# Altium schematic sheet Recovery.SchDoc
size Letter; Organization: Altium Limited; Address1: L3, 12a Rodborough Rd; Address2: Frenchs Forest; Address3: NSW; Address4: Australia 2086
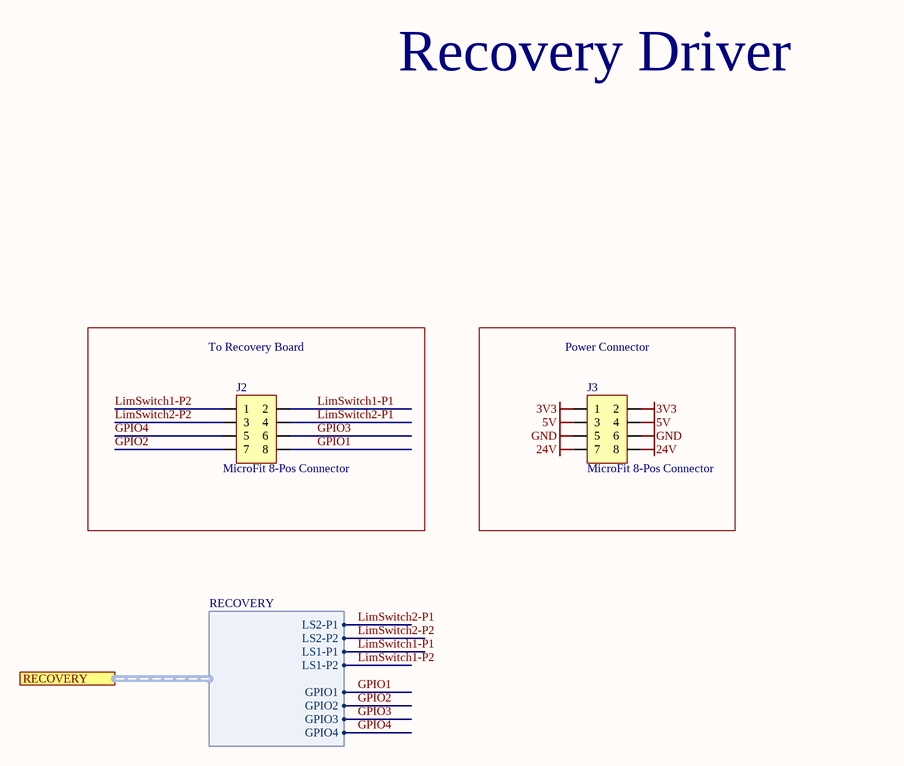
[diagram p0: Recovery.SchDoc]

## Parts
J2  MicroFit 8-Pos Connector  [Microfit-8Pos]
J3  MicroFit 8-Pos Connector  [Microfit-8Pos]

## Blocks framed on the sheet
To Recovery Board: J2
Power Connector: J3

## Ports
RECOVERY (harness RECOVERY)

## Harnesses
RECOVERY: LS2-P1, LS2-P2, LS1-P1, LS1-P2, GPIO1, GPIO2, GPIO3, GPIO4

## Nets
3V3: J3.1 J3.2
5V: J3.3 J3.4
24V: J3.7 J3.8
GND: J3.5 J3.6
GPIO1: J2.8 ; port RECOVERY.GPIO1
GPIO2: J2.7 ; port RECOVERY.GPIO2
GPIO3: J2.6 ; port RECOVERY.GPIO3
GPIO4: J2.5 ; port RECOVERY.GPIO4
LimSwitch1-P1: J2.2 ; port RECOVERY.LS1-P1
LimSwitch1-P2: J2.1 ; port RECOVERY.LS1-P2
LimSwitch2-P1: J2.4 ; port RECOVERY.LS2-P1
LimSwitch2-P2: J2.3 ; port RECOVERY.LS2-P2

## Notes on the sheet
- Recovery Driver
- Title
- Size:
- Date:
- Letter
- Number:
- Time:
- Revision:
- Sheet
- of
- File:

## Library data of the parts
J2 J3 = Micro-Fit 8Pos: Molex MicroFit 8-Pos Connector; URL: https://www.digikey.com/products/en?WT.z_cid=sp_900_0310_buynow&keywords=430450813; DigiKey PN: WM2651-ND